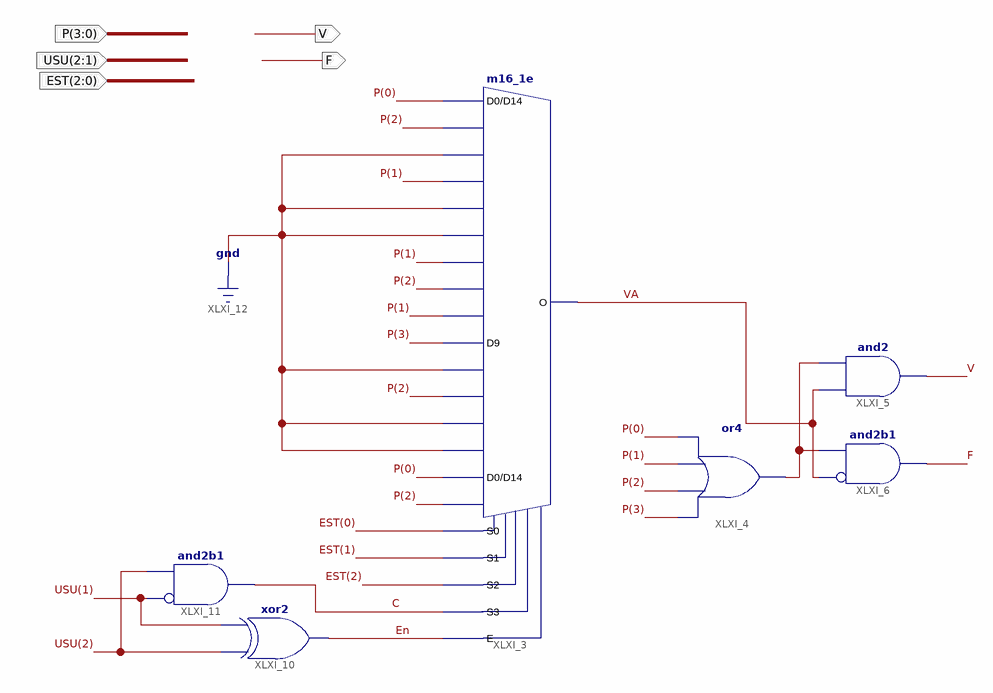
[diagram p0: schematic sheet 1]
// Xilinx ISE schematic VCodAc.sch (spartan6) as structural Verilog: 6 symbols, 5 ports
module VCodAc (
  input  [3:0] P,
  input  [2:1] USU,
  input  [2:0] EST,
  output F,
  output V
);

  wire C, En, VA, XLXN_5;

  m16_1e XLXI_3 (
    .D0(P[0]), .D1(P[2]), .D10(1'b0), .D11(P[2]), .D12(1'b0), .D13(1'b0), .D14(P[0]), .D15(P[2]), .D2(1'b0),
    .D3(P[1]), .D4(1'b0), .D5(1'b0), .D6(P[1]), .D7(P[2]), .D8(P[1]), .D9(P[3]), .E(En), .S0(EST[0]),
    .S1(EST[1]), .S2(EST[2]), .S3(C), .O(VA));
  or XLXI_4 (XLXN_5, P[3], P[2], P[1], P[0]);
  and XLXI_6 (F, ~VA, XLXN_5);  // and2b1
  and XLXI_5 (V, VA, XLXN_5);
  xor XLXI_10 (En, USU[2], USU[1]);
  and XLXI_11 (C, ~USU[1], USU[2]);  // and2b1
endmodule
